# EasyEDA Pro project PCB设计进阶.eprj

# Schematic Schematic1

## Sheets
1 38译码电路: Board Name: Board1; Create Date: 2024-08-05
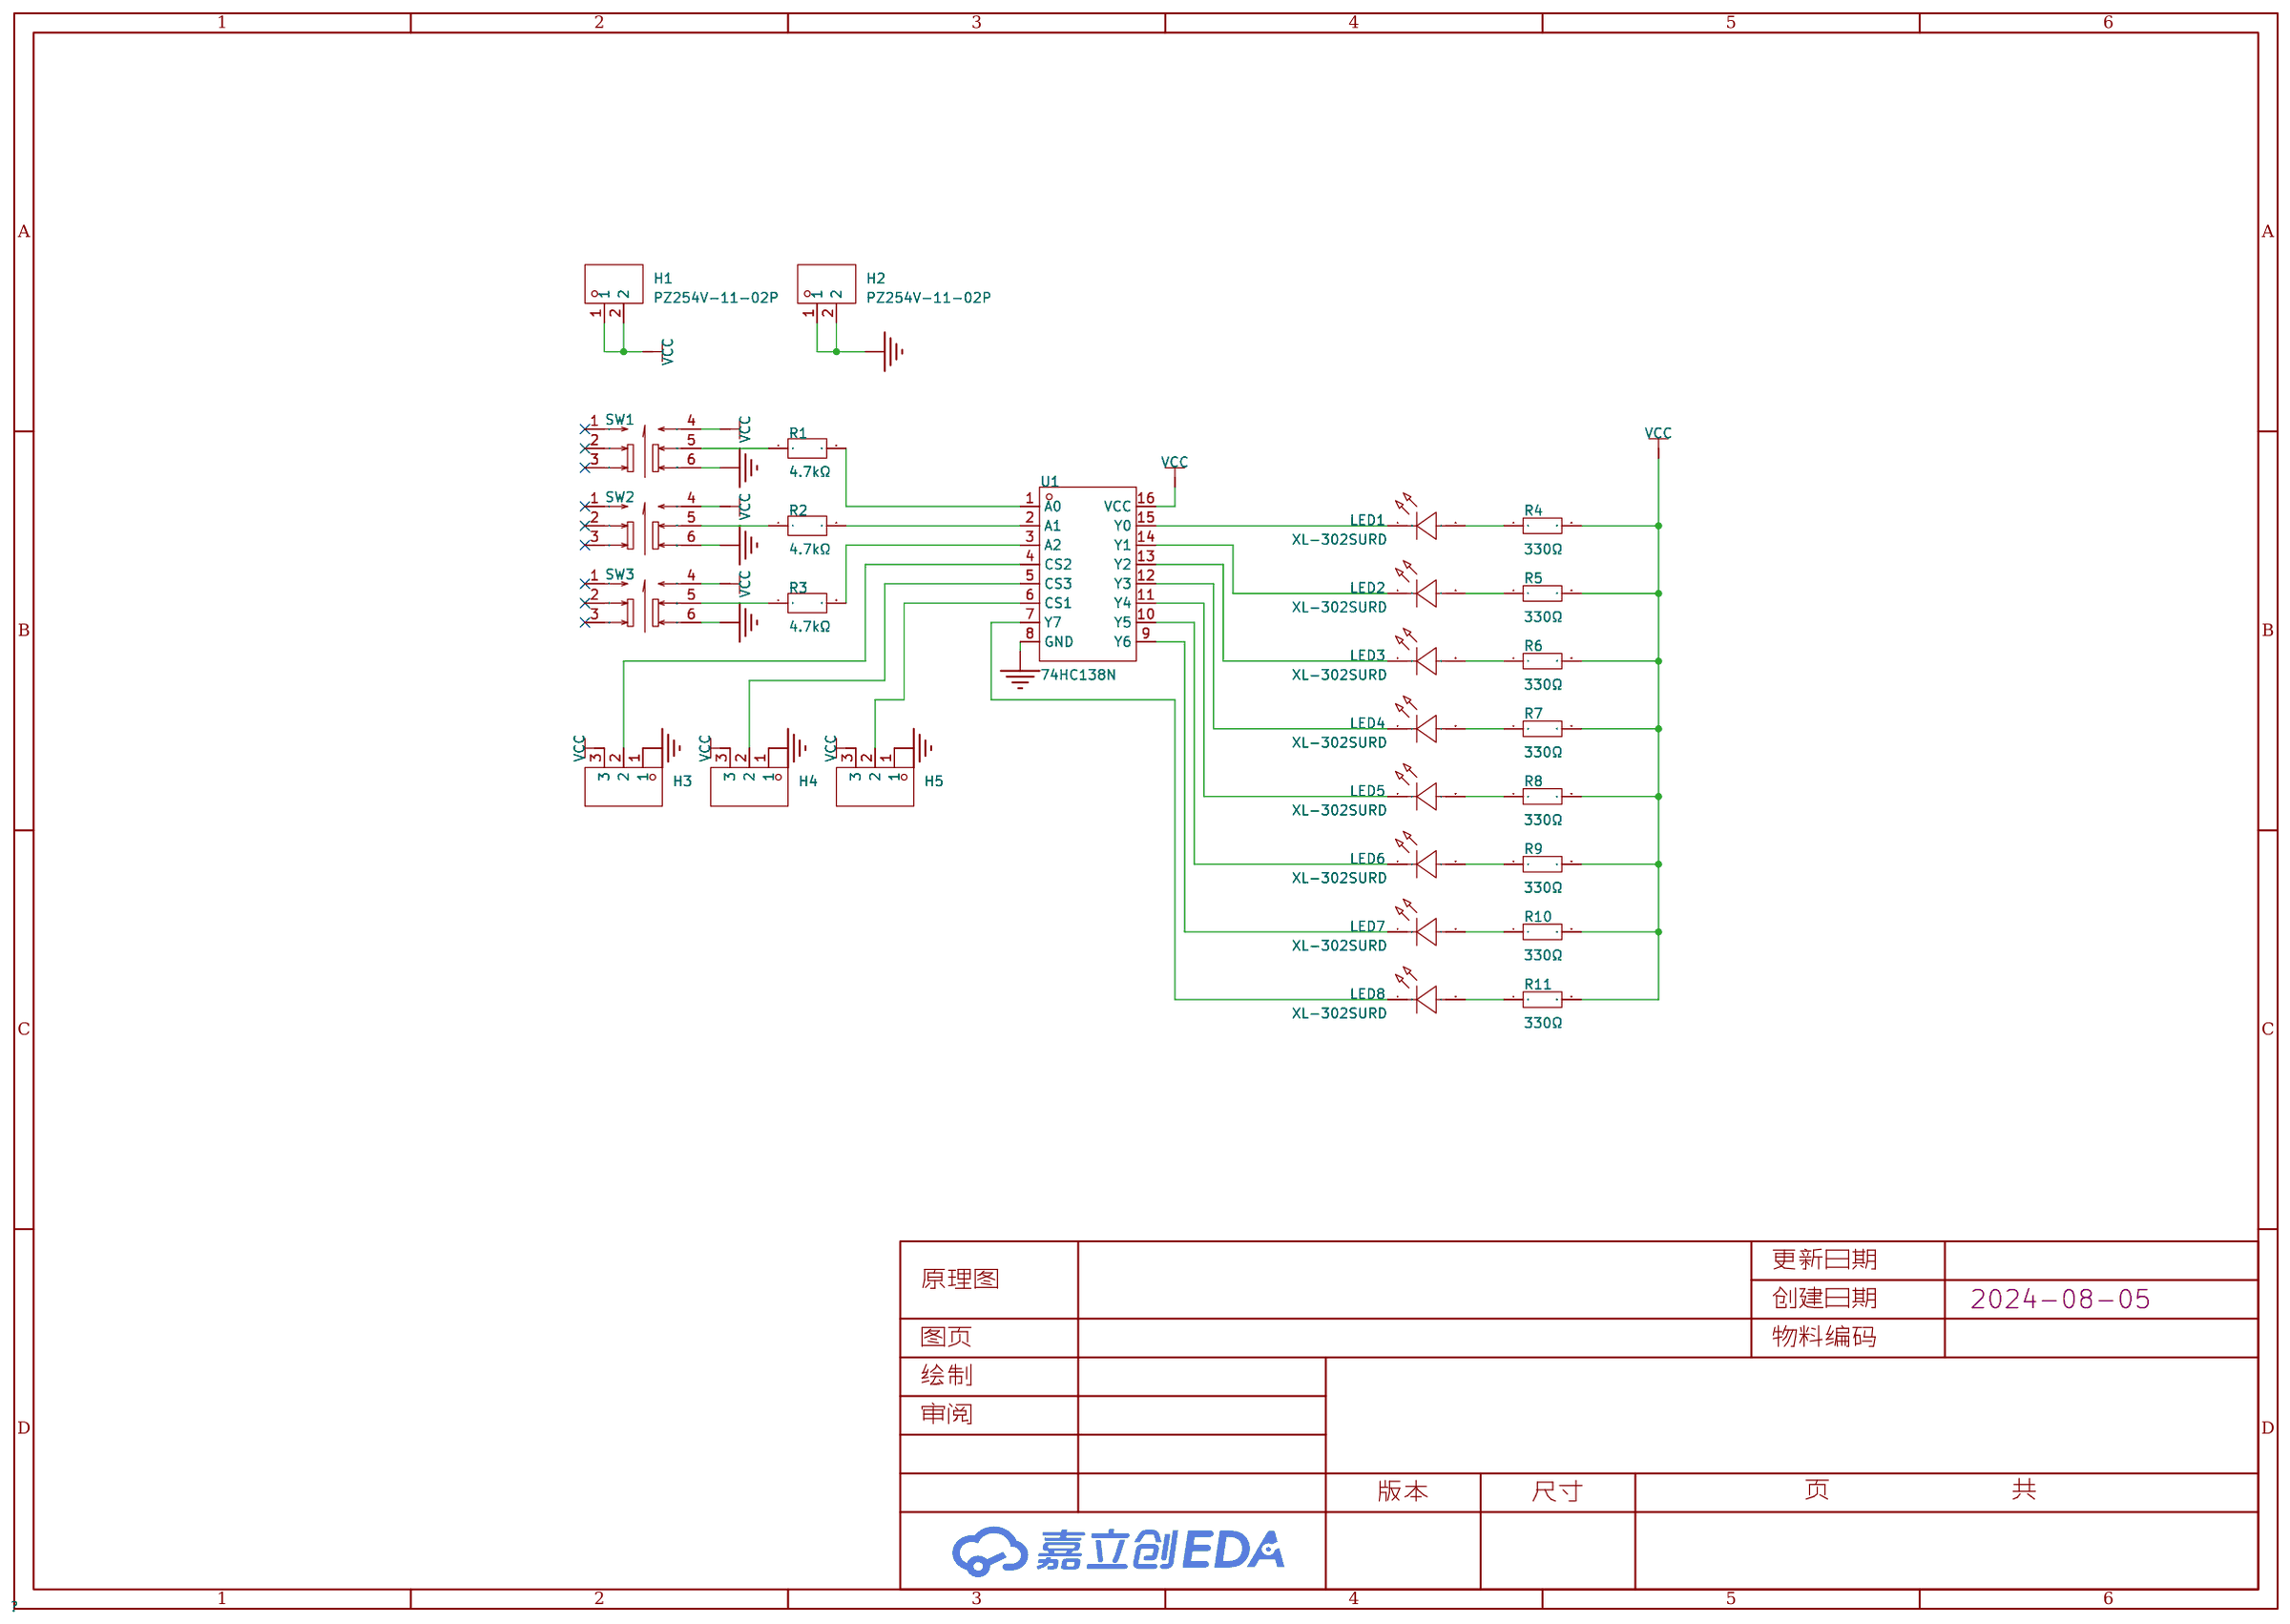
[diagram p0: 38译码电路]
2 245信号放大电路: Create Date: 2024-08-06
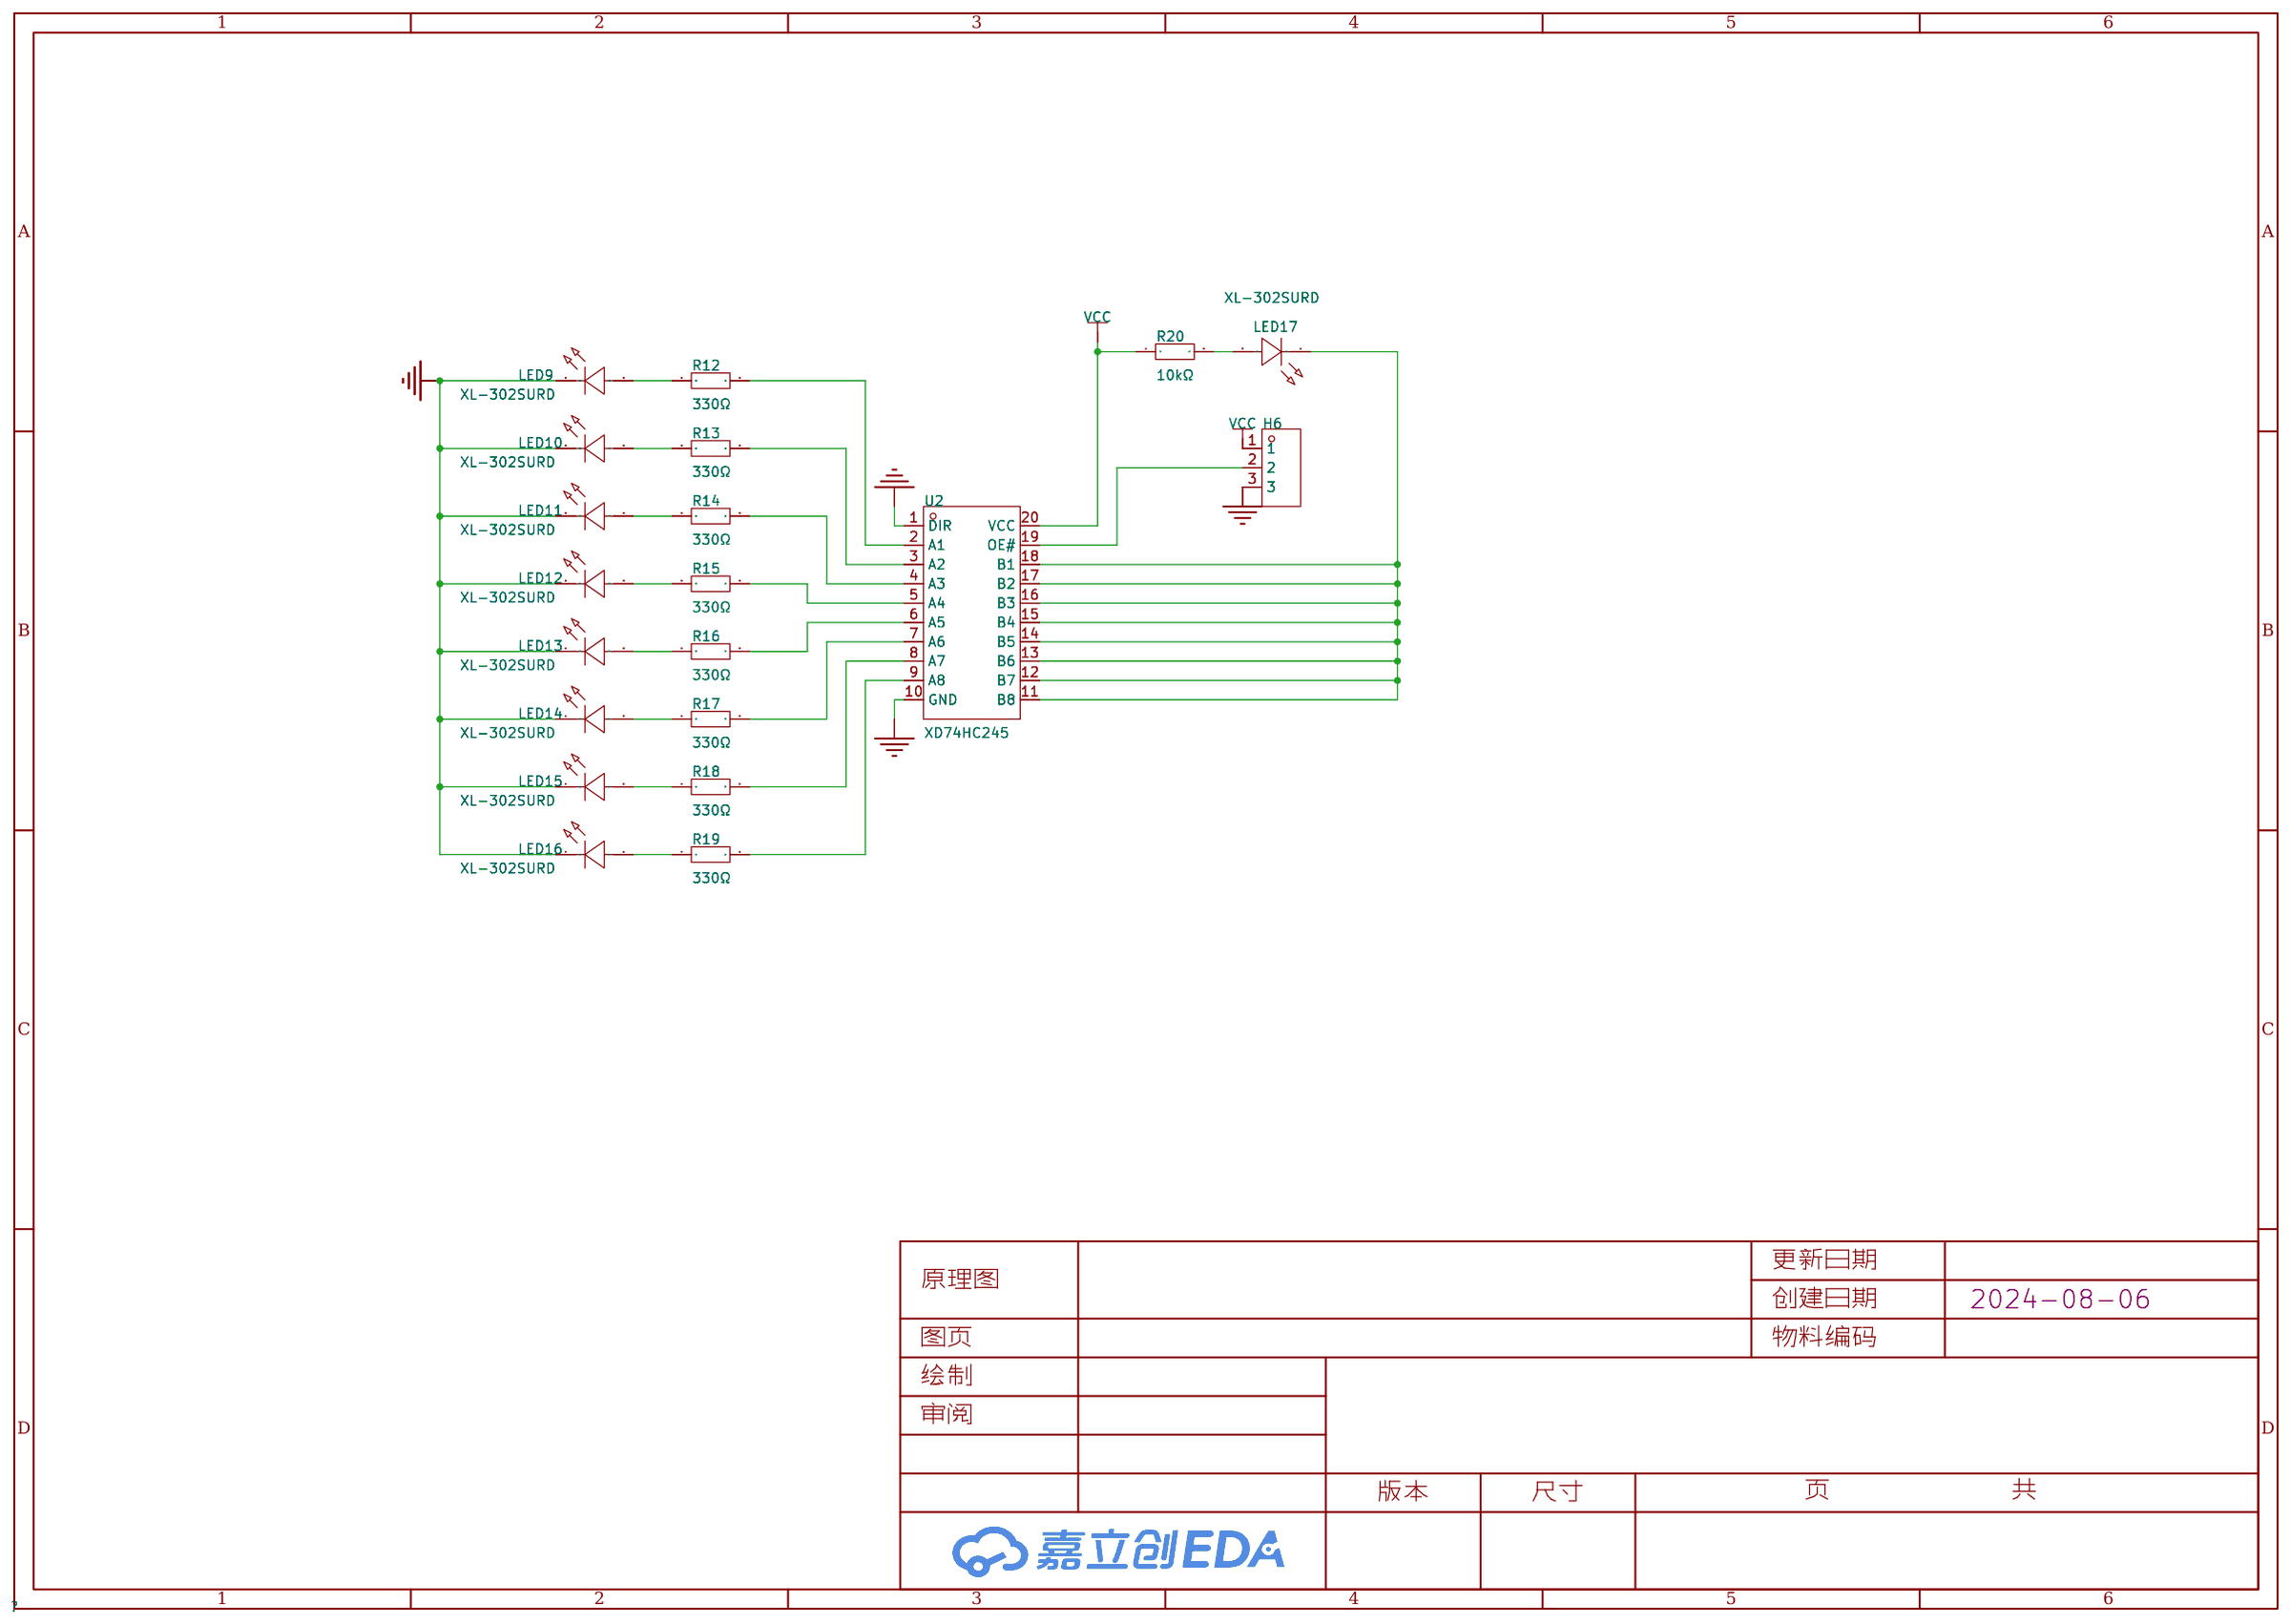
[diagram p1: 245信号放大电路]
3 usb供电: Create Date: 2024-08-06
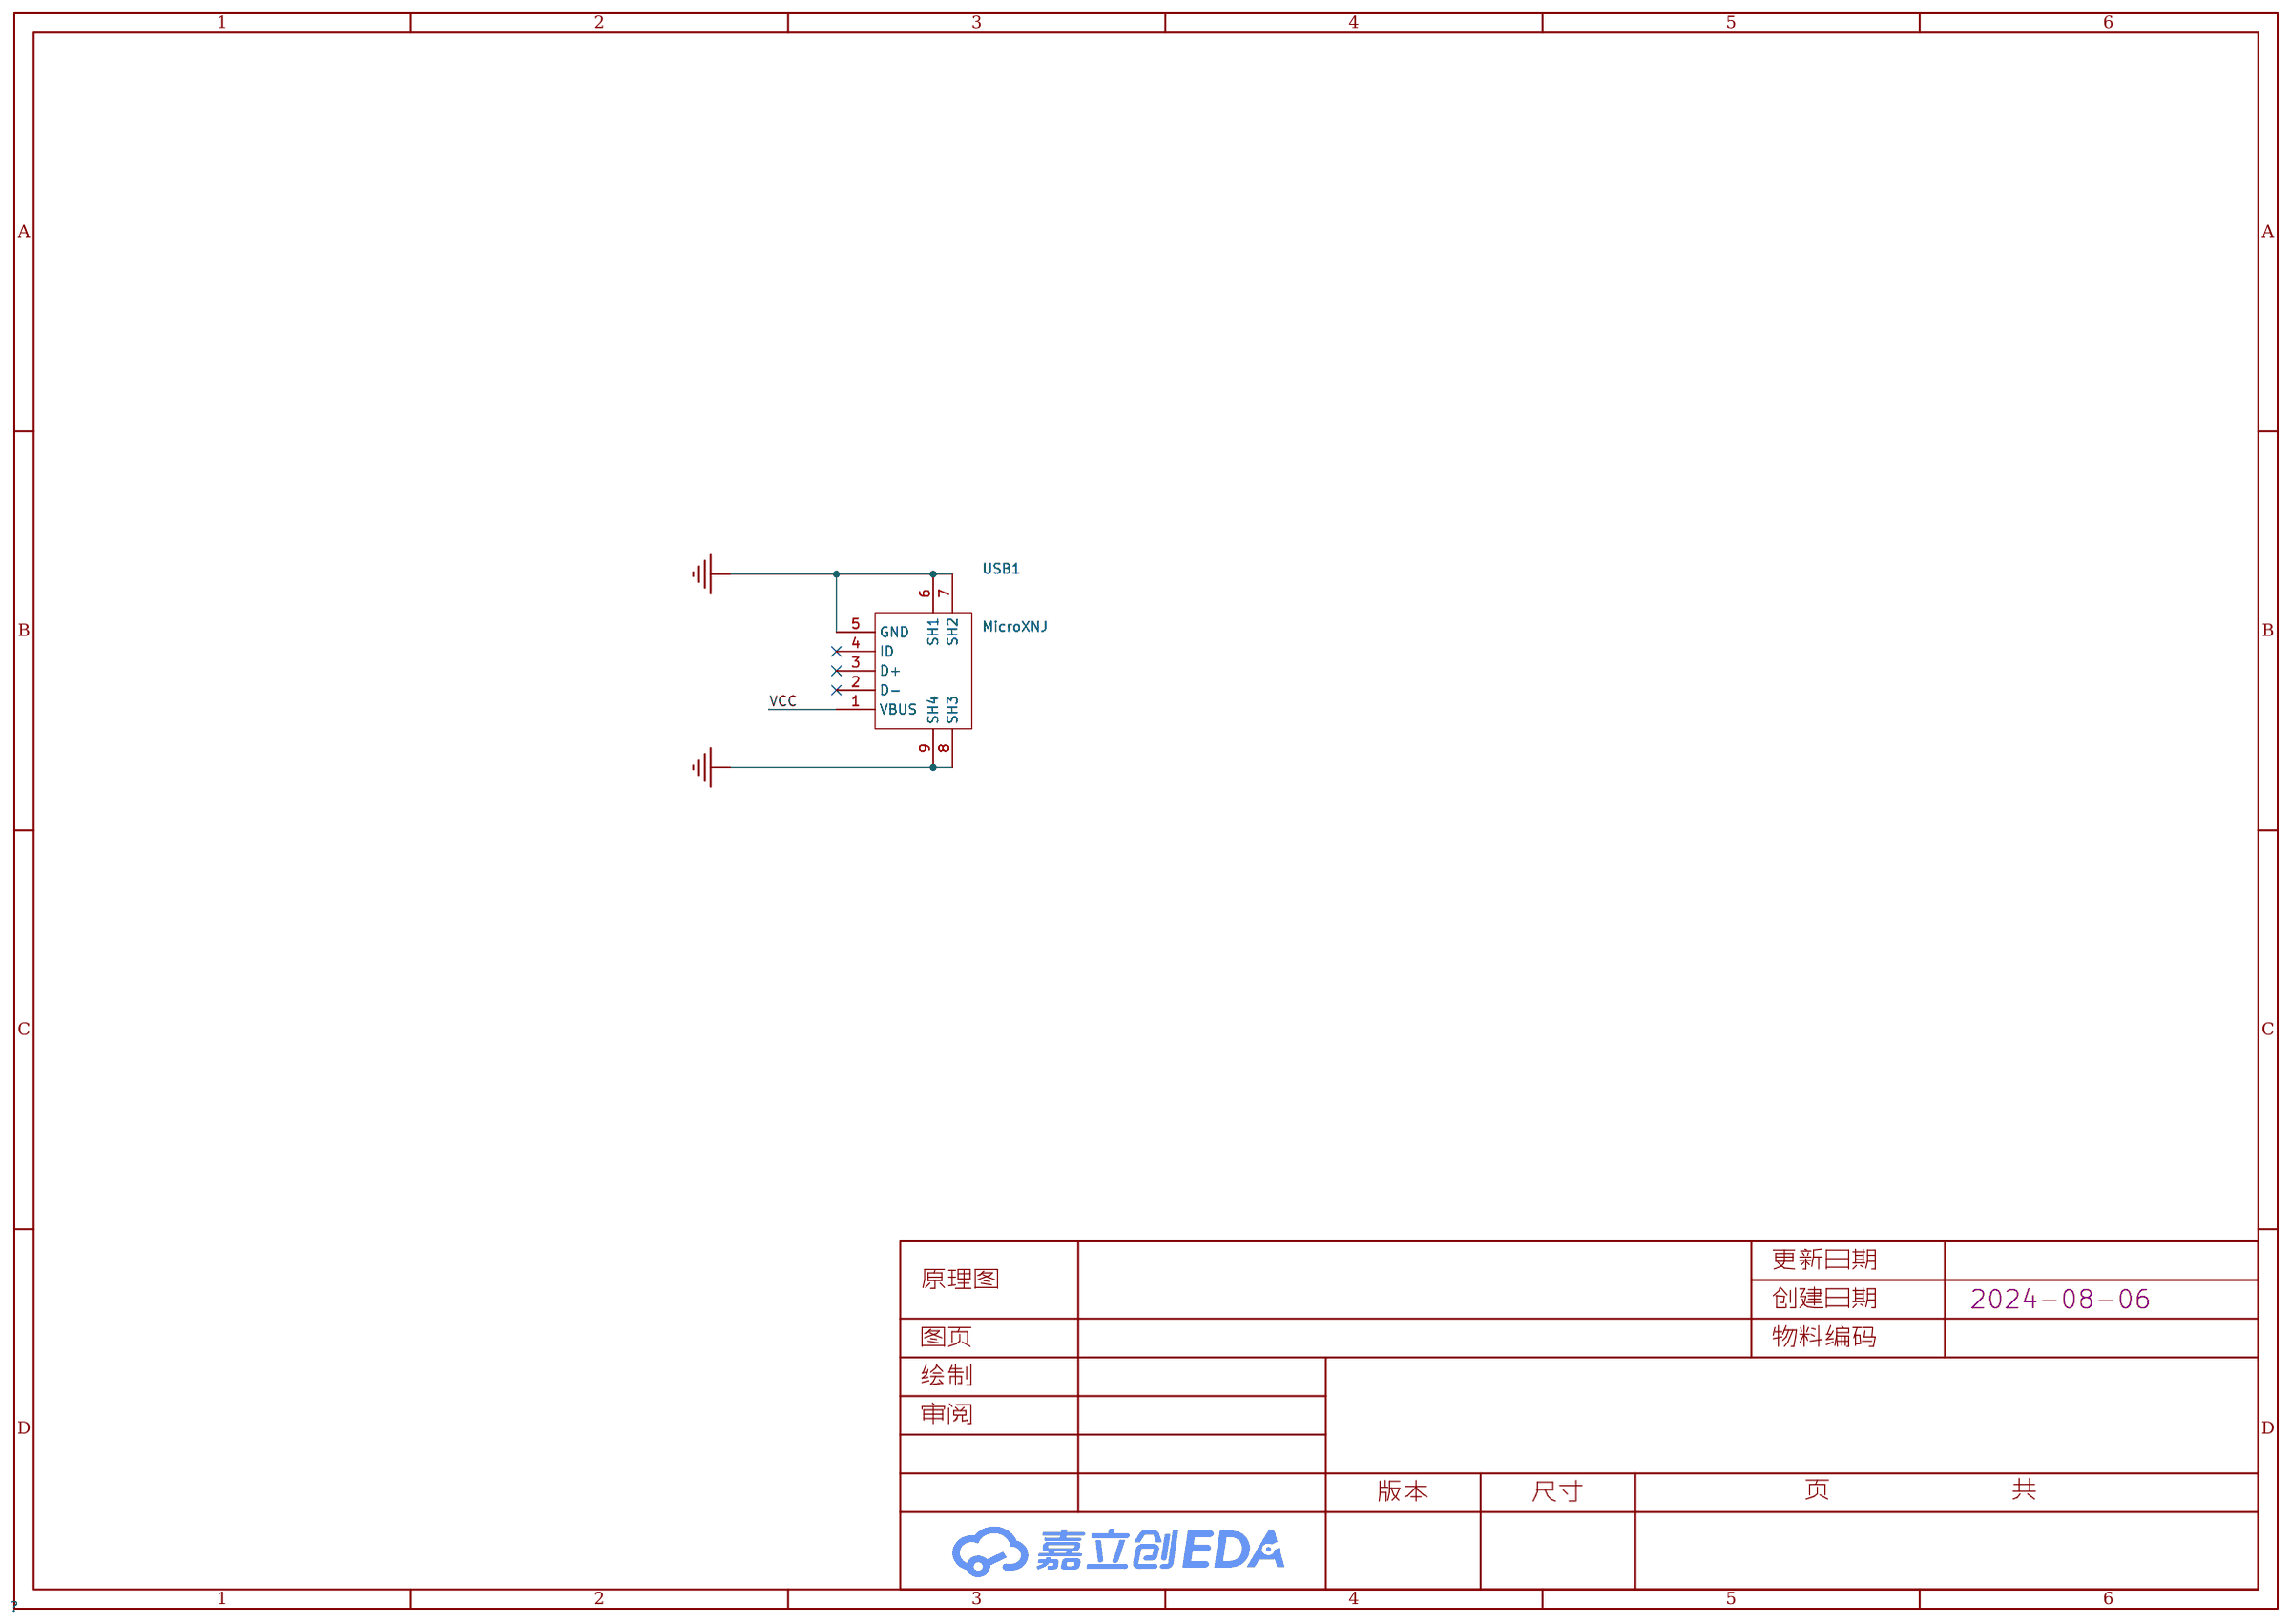
[diagram p2: usb供电]

## Parts
sheet 38译码电路
H1  PZ254V-11-02P  [HDR-TH_2P-P2.54-V-M]
H2  PZ254V-11-02P  [HDR-TH_2P-P2.54-V-M]
H3  PZ254V-11-03P  [HDR-TH_3P-P2.54-V-M]
H4  PZ254V-11-03P  [HDR-TH_3P-P2.54-V-M]
H5  PZ254V-11-03P  [HDR-TH_3P-P2.54-V-M]
LED1  XL-302SURD  [LED-TH_BD3.8-P2.54-RD]
LED2  XL-302SURD  [LED-TH_BD3.8-P2.54-RD]
LED3  XL-302SURD  [LED-TH_BD3.8-P2.54-RD]
LED4  XL-302SURD  [LED-TH_BD3.8-P2.54-RD]
LED5  XL-302SURD  [LED-TH_BD3.8-P2.54-RD]
LED6  XL-302SURD  [LED-TH_BD3.8-P2.54-RD]
LED7  XL-302SURD  [LED-TH_BD3.8-P2.54-RD]
LED8  XL-302SURD  [LED-TH_BD3.8-P2.54-RD]
R1  4.7kΩ  [RES-TH_BD2.4-L6.3-P10.30-D0.6]
R2  4.7kΩ  [RES-TH_BD2.4-L6.3-P10.30-D0.6]
R3  4.7kΩ  [RES-TH_BD2.4-L6.3-P10.30-D0.6]
R4  330Ω  [RES-TH_BD2.3-L3.7-P7.70-D0.9]
R5  330Ω  [RES-TH_BD2.3-L3.7-P7.70-D0.9]
R6  330Ω  [RES-TH_BD2.3-L3.7-P7.70-D0.9]
R7  330Ω  [RES-TH_BD2.3-L3.7-P7.70-D0.9]
R8  330Ω  [RES-TH_BD2.3-L3.7-P7.70-D0.9]
R9  330Ω  [RES-TH_BD2.3-L3.7-P7.70-D0.9]
R10  330Ω  [RES-TH_BD2.3-L3.7-P7.70-D0.9]
R11  330Ω  [RES-TH_BD2.3-L3.7-P7.70-D0.9]
SW1  XKB7070-Z  [SW-TH_6P-L7.0-W7.0-P2.00]
SW2  XKB7070-Z  [SW-TH_6P-L7.0-W7.0-P2.00]
SW3  XKB7070-Z  [SW-TH_6P-L7.0-W7.0-P2.00]
U1  74HC138N  [DIP-16_L19.2-W6.6-P2.54-LS7.6-BL]
sheet 245信号放大电路
H6  PZ254V-11-03P  [HDR-TH_3P-P2.54-V-M]
LED9  XL-302SURD  [LED-TH_BD3.8-P2.54-RD]
LED10  XL-302SURD  [LED-TH_BD3.8-P2.54-RD]
LED11  XL-302SURD  [LED-TH_BD3.8-P2.54-RD]
LED12  XL-302SURD  [LED-TH_BD3.8-P2.54-RD]
LED13  XL-302SURD  [LED-TH_BD3.8-P2.54-RD]
LED14  XL-302SURD  [LED-TH_BD3.8-P2.54-RD]
LED15  XL-302SURD  [LED-TH_BD3.8-P2.54-RD]
LED16  XL-302SURD  [LED-TH_BD3.8-P2.54-RD]
LED17  XL-302SURD  [LED-TH_BD3.8-P2.54-RD]
R12  330Ω  [RES-TH_BD2.3-L3.7-P7.70-D0.9]
R13  330Ω  [RES-TH_BD2.3-L3.7-P7.70-D0.9]
R14  330Ω  [RES-TH_BD2.3-L3.7-P7.70-D0.9]
R15  330Ω  [RES-TH_BD2.3-L3.7-P7.70-D0.9]
R16  330Ω  [RES-TH_BD2.3-L3.7-P7.70-D0.9]
R17  330Ω  [RES-TH_BD2.3-L3.7-P7.70-D0.9]
R18  330Ω  [RES-TH_BD2.3-L3.7-P7.70-D0.9]
R19  330Ω  [RES-TH_BD2.3-L3.7-P7.70-D0.9]
R20  10kΩ  [RES-TH_BD2.3-L6.5-P10.50-D0.5]
U2  XD74HC245  [DIP-20_L26.8-W6.4-P2.54-LS7.6-BL]
sheet usb供电
USB1  MicroXNJ  [MICRO-USB-SMD_MICROXNJ]

## Library data of the parts
H1 H2 = PZ254V-11-02P: LCSC Part Name: 间距:2.54mm 1x2P 直插 方针; Supplier Part: C492401; Manufacturer: XFCN(兴飞); Supplier Footprint: 插件,P=2.54mm; JLCPCB Part Class: 扩展库; Datasheet: https://atta.szlcsc.com/upload/public/pdf/source/20200309/C492401_A812433581A9B211A7FFA413ADDFF0E5.pdf; Supplier: LCSC; Pin Structure: 1x2P; Pitch: 2.54mm; Circluar Pins/Square Pins: 方针; Mounting Type: 直插; Number of Rows: 单排; Number of Pins: 2P; Length of Mating Pin: 6mm; Insulation Height: 2.5mm; Length of End Connection Pin: 3mm; Contact Material: 黄铜; Operating Temperature Range: -40℃~+105℃; Color: 黑色
H3-H6 = PZ254V-11-03P: LCSC Part Name: 间距:2.54mm 1x3P 直插 方针; Supplier Part: C2937625; Manufacturer: XFCN(兴飞); Supplier Footprint: 插件,P=2.54mm; JLCPCB Part Class: 扩展库; Datasheet: https://atta.szlcsc.com/upload/public/pdf/source/20200309/C492402_8335C3D49C4E4C618838D59BB1D024C1.pdf; Supplier: LCSC; Pin Structure: 1x3P; Pitch: 2.54mm; Circluar Pins/Square Pins: 方针; Mounting Type: 直插; Number of Rows: 单排; Number of Pins: 3P; Current Rating (Max): 3A; Voltage Rating (Max): 250V; Length of Mating Pin: 6mm; Insulation Height: 2.5mm; Length of End Connection Pin: 3mm; Operating Temperature Range: -40℃~+105℃; Color: 黑色
LED1-LED17 = XL-302SURD: Supplier Part: C2895470; Manufacturer: XINGLIGHT(成兴光); Supplier Footprint: 插件,D=3mm; JLCPCB Part Class: 扩展库; Datasheet: https://atta.szlcsc.com/upload/public/pdf/source/20240112/E1E2B82945FD635E4907401DDE6D4922.pdf; Supplier: LCSC; Lamp Holder Type: 3mm圆形灯头; Emitted Color: 红色; Power Dissipation: 80mW; Forward Current: 30mA; Dominant Wavelength: 615nm~620nm; Peak Wavelength: 625nm; Lens Color: 红色透镜; Viewing Angle: 50°; Operating Temperature: -25℃~+85℃
R1-R3 = RN1/4W4K7FT/BA1: LCSC Part Name: 4.7kΩ ±1% 250mW 金属膜电阻; Supplier Part: C410614; Manufacturer: Tyohm(幸亚电阻); Supplier Footprint: 插件,D2.4xL6.5mm; JLCPCB Part Class: 扩展库; Datasheet: https://atta.szlcsc.com/upload/public/pdf/source/20190808/C410699_D126E64D28B638F1D73B58E9F61DFD9B.pdf; Supplier: LCSC; Type: 金属膜电阻; Tolerance: ±1%; Overload Voltage (Max): 250V; Power(Watts): 250mW; Temperature Coefficient: ±50ppm/℃; Operating Temperature Range: -55℃~+125℃
R4-R19 = MF1/8W-330Ω±1%-OT52: LCSC Part Name: 金属膜电阻 330Ω ±1% 125mW; Supplier Part: C2848567; Manufacturer: VO(翔胜); Supplier Footprint: 插件,D2.3xL3.7mm; JLCPCB Part Class: 扩展库; Supplier: LCSC; Type: 金属膜电阻; Tolerance: ±1%; Overload Voltage (Max): 200V; Power(Watts): 125mW; Temperature Coefficient: ±350ppm/℃; Operating Temperature Range: -55℃~+155℃
SW1-SW3 = XKB7070-Z: LCSC Part Name: 按键开关   7*7插件自锁 蓝白黑; Supplier Part: C318863; Manufacturer: XKB Connectivity(中国星坤); Supplier Footprint: 插件; JLCPCB Part Class: 扩展库; Datasheet: https://atta.szlcsc.com/upload/public/pdf/source/20211015/75A682A27A424BDE8D93C2CFA14C38FE.pdf; Supplier: LCSC; Self Lock / No Lock: 自锁; Actuator Style: 矩形按钮; Mounting Style: 直插; Contact Current: 100mA; Voltage Rating (AC): 250V; Voltage Rating (DC): 30V; Insulation Resistance: 100MΩ; Actuator/Cap Color: 蓝色; With Lamp: 不带; Pin Style: PC引脚; Operating Force: 160gf; Operating Temperature: -15℃~+55℃; Mechanical Life: 10万次
U1 = 74HC138N: LCSC Part Name: 3 线路至 8 线路解码器/多路解复用器; Supplier Part: C507188; Manufacturer: HGSEMI(华冠); Supplier Footprint: DIP-16; JLCPCB Part Class: 扩展库; Datasheet: https://atta.szlcsc.com/upload/public/pdf/source/20200402/C507188_F3819AAFA86CA4EC01049E7C3DE0780C.pdf; Supplier: LCSC
R20 = RI40-1/4W-10KΩ±5%T: LCSC Part Name: 玻璃釉电阻 10kΩ ±5% 250mW 粉色漆; Supplier Part: C714634; Manufacturer: 华星机电; Supplier Footprint: 插件; JLCPCB Part Class: 扩展库; Datasheet: https://atta.szlcsc.com/upload/public/pdf/source/20200731/C714531_AD63ADE1939354DF9C89AA88364E3DE5.pdf; Supplier: LCSC; Type: 玻璃釉电阻; Tolerance: ±5%; Power(Watts): 250mW; Temperature Coefficient: ±200ppm/℃; Operating Temperature Range: -55℃~+125℃
U2 = XD74HC245: LCSC Part Name: 总线收发器; Supplier Part: C561305; Manufacturer: XINLUDA(信路达); Supplier Footprint: DIP-20; JLCPCB Part Class: 扩展库; Datasheet: https://atta.szlcsc.com/upload/public/pdf/source/20240111/A572988226579F08DBAC30D4B3CE857F.pdf; Supplier: LCSC
USB1 = MicroXNJ: LCSC Part Name: Micro-B 母 卧贴; Supplier Part: C404969; Manufacturer: SHOU HAN(首韩); Supplier Footprint: SMD; JLCPCB Part Class: 扩展库; Datasheet: https://atta.szlcsc.com/upload/public/pdf/source/20220415/2494EDFF499AF6F852F7C820374B6AF3.pdf; Supplier: LCSC; Connector Type: Micro-B; Standard: USB 2.0; Gender: 母; Mounting Style: 卧贴; Number of Contacts: 5P; Number of Ports: 1; Current Rating - Power (Max): 1A; Operating Temperature Range: -20℃~+85℃

## Nets
GND: H2.1 H2.2 H3.1 H4.1 H5.1 H6.3 LED9.1(K) LED10.1(K) LED11.1(K) LED12.1(K) LED13.1(K) LED14.1(K) LED15.1(K) LED16.1(K) SW1.6 SW2.6 SW3.6 U1.8(GND) U2.1(DIR) U2.10(GND) USB1.5(GND) USB1.6(SH1) USB1.7(SH2) USB1.8(SH3) USB1.9(SH4)
VCC: H1.1 H1.2 H3.3 H4.3 H5.3 H6.1 R4.2 R5.2 R6.2 R7.2 R8.2 R9.2 R10.2 R11.2 R20.1 SW1.4 SW2.4 SW3.4 U1.16(VCC) U2.20(VCC) USB1.1(VBUS)
$1N957: R1.2 U1.1(A0)
$1N969: R3.2 U1.3(A2)
$1N1133: R2.1 SW2.5
$1N1140: R1.1 SW1.5
$1N1148: R3.1 SW3.5
$1N1162: R2.2 U1.2(A1)
$1N1502: H3.2 U1.4(CS2)
$1N1509: H4.2 U1.5(CS3)
$1N1517: H5.2 U1.6(CS1)
$1N1681: LED1.2(A) R4.1
$1N1764: LED2.2(A) R5.1
$1N2002: LED3.2(A) R6.1
$1N2004: LED4.2(A) R7.1
$1N2318: LED5.2(A) R8.1
$1N2320: LED6.2(A) R9.1
$1N2322: LED7.2(A) R10.1
$1N2324: LED8.2(A) R11.1
$1N2481: LED1.1(K) U1.15(Y0)
$1N2515: LED4.1(K) U1.12(Y3)
$1N2530: LED5.1(K) U1.11(Y4)
$1N2537: LED6.1(K) U1.10(Y5)
$1N2544: LED7.1(K) U1.9(Y6)
$1N2551: LED8.1(K) U1.7(Y7)
$1N2573: LED2.1(K) U1.14(Y1)
$1N2577: LED3.1(K) U1.13(Y2)
$2N664: LED9.2(A) R12.1
$2N666: LED10.2(A) R13.1
$2N668: LED11.2(A) R14.1
$2N670: LED12.2(A) R15.1
$2N672: LED13.2(A) R16.1
$2N674: LED14.2(A) R17.1
$2N676: LED15.2(A) R18.1
$2N678: LED16.2(A) R19.1
$2N1075: R15.2 U2.5(A4)
$2N1092: R16.2 U2.6(A5)
$2N1099: R14.2 U2.4(A3)
$2N1109: R13.2 U2.3(A2)
$2N1119: R12.2 U2.2(A1)
$2N1129: R17.2 U2.7(A6)
$2N1136: R18.2 U2.8(A7)
$2N1143: R19.2 U2.9(A8)
$2N1301: LED17.2(A) R20.2
$2N1318: LED17.1(K) U2.11(B8) U2.12(B7) U2.13(B6) U2.14(B5) U2.15(B4) U2.16(B3) U2.17(B2) U2.18(B1)
$2N1542: H6.2 U2.19(OE#)

Not connected (* = marked no-connect by the designer): SW1 1* 2* 3*; SW2 1* 2* 3*; SW3 1* 2* 3*; USB1 2(D-)* 3(D+)* 4(ID)*

# Board PCB1
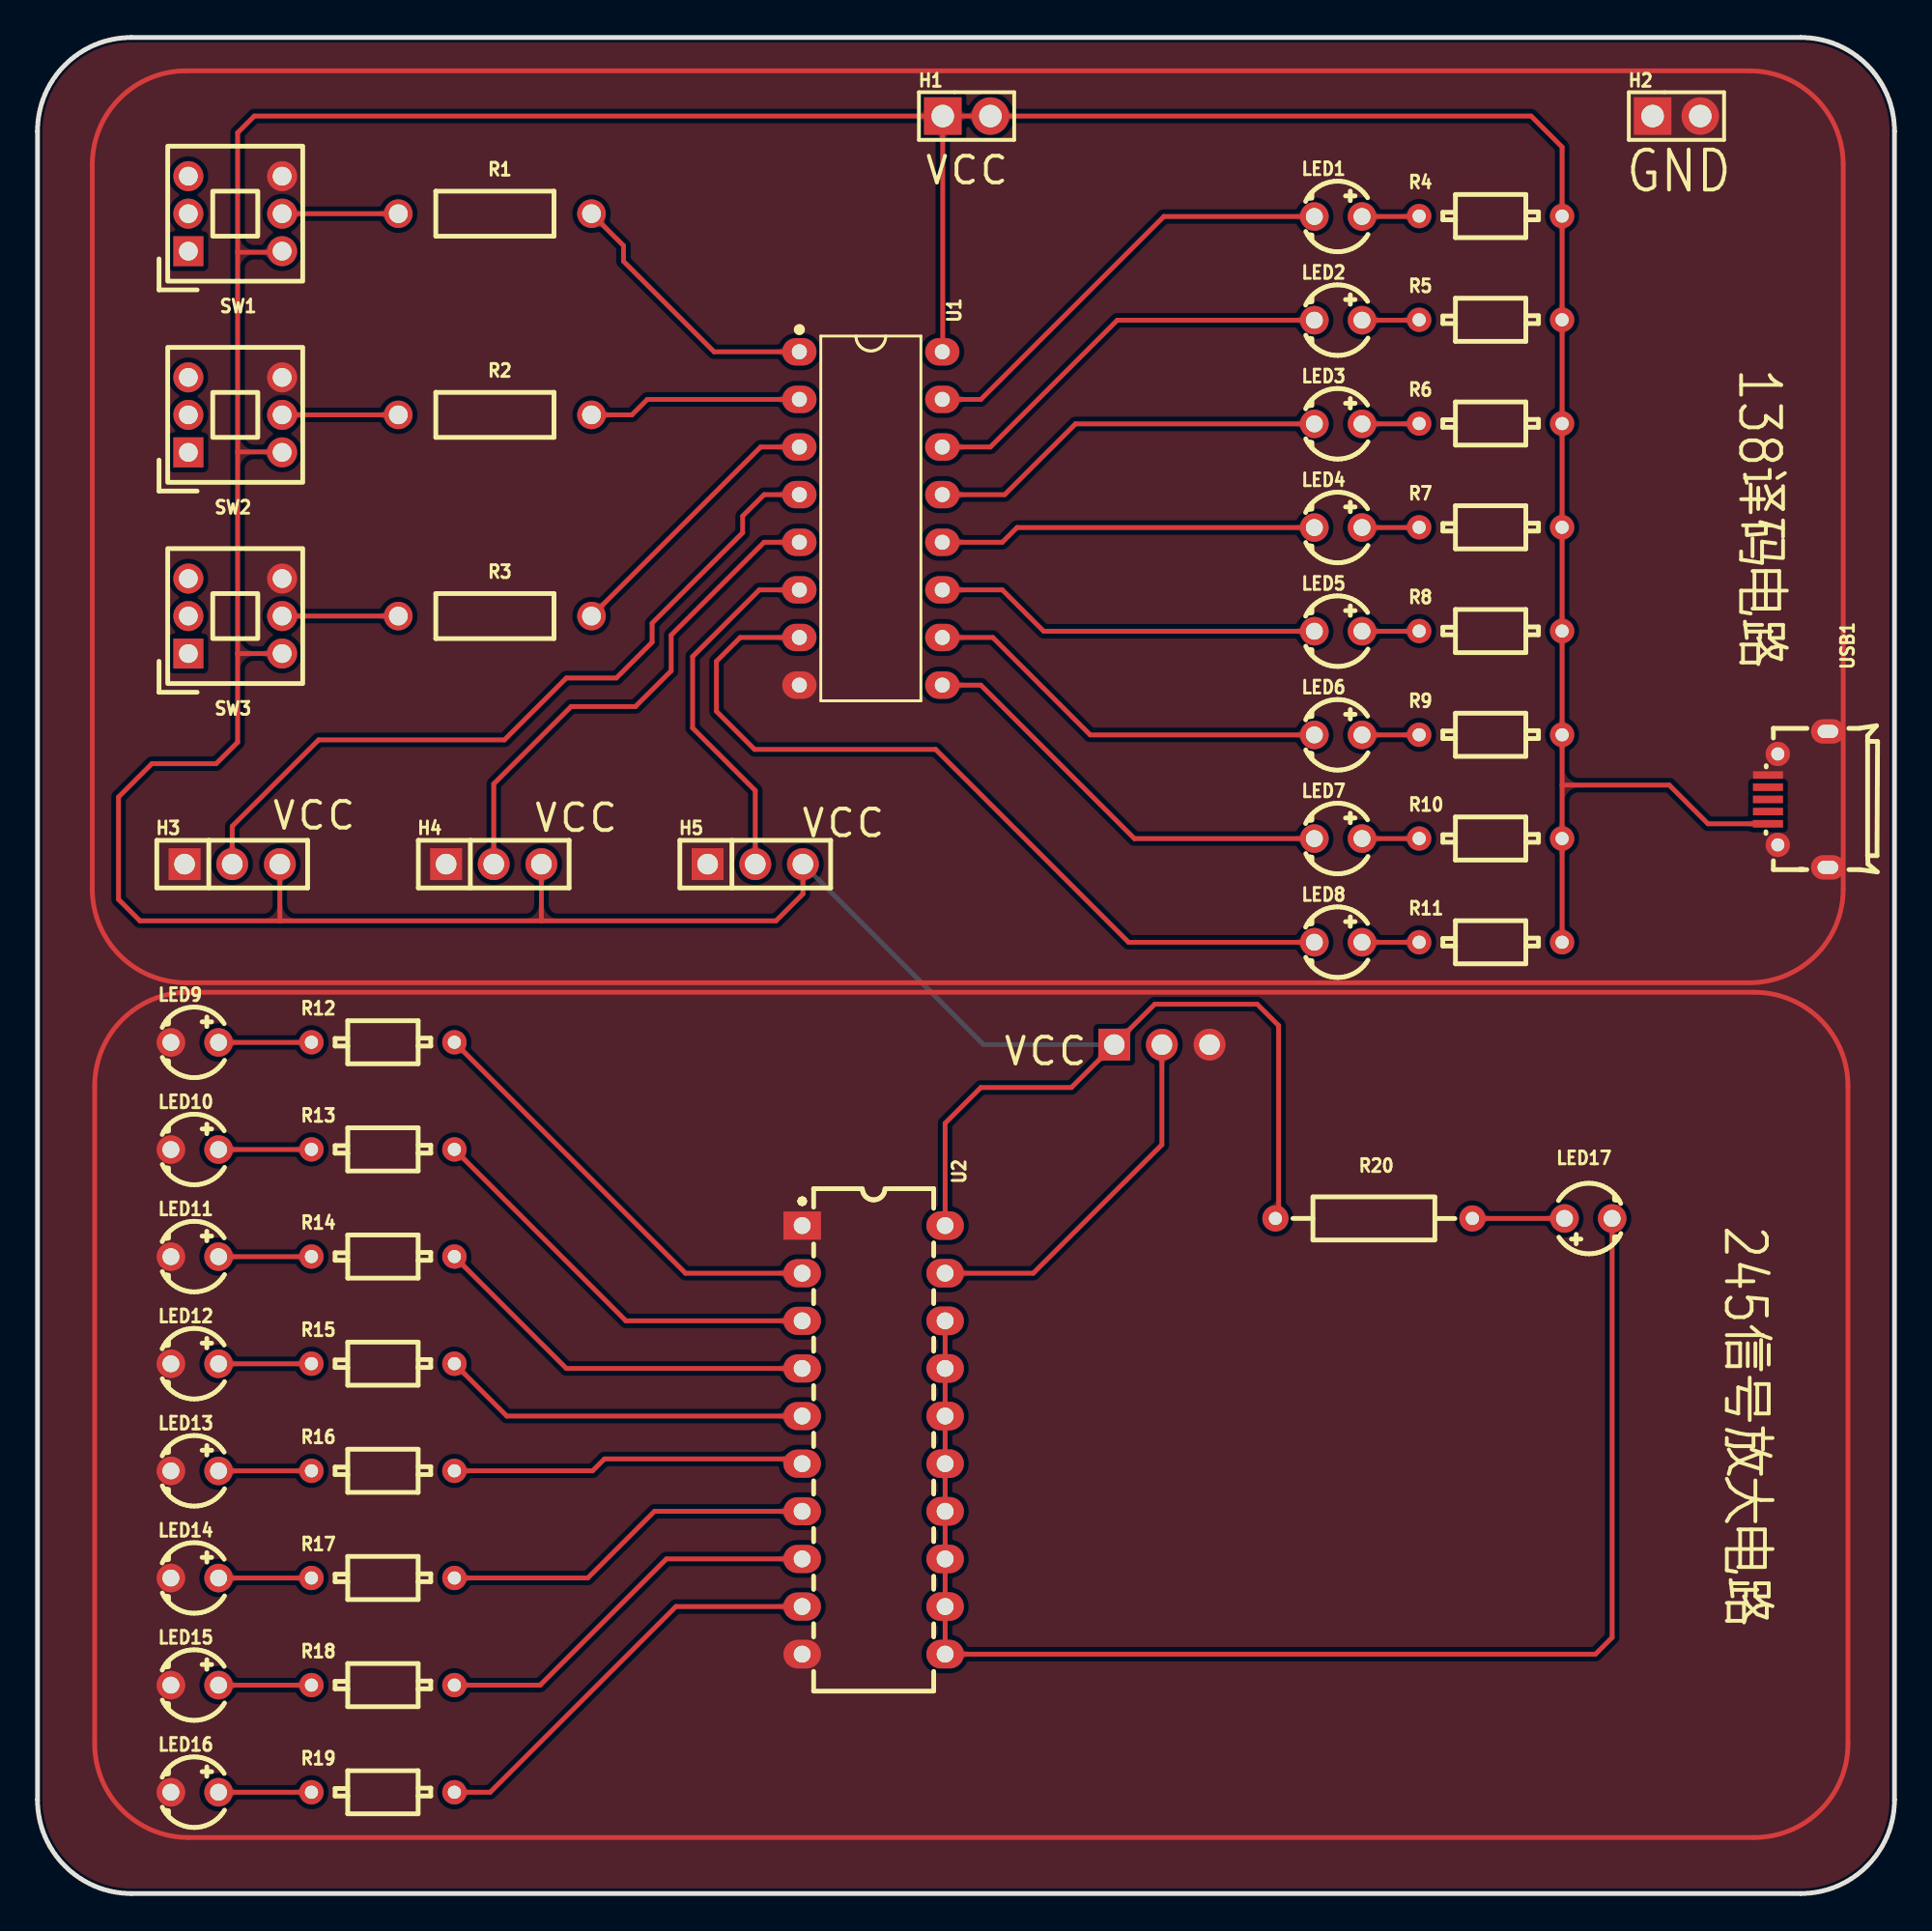
[diagram p3: board, top side]
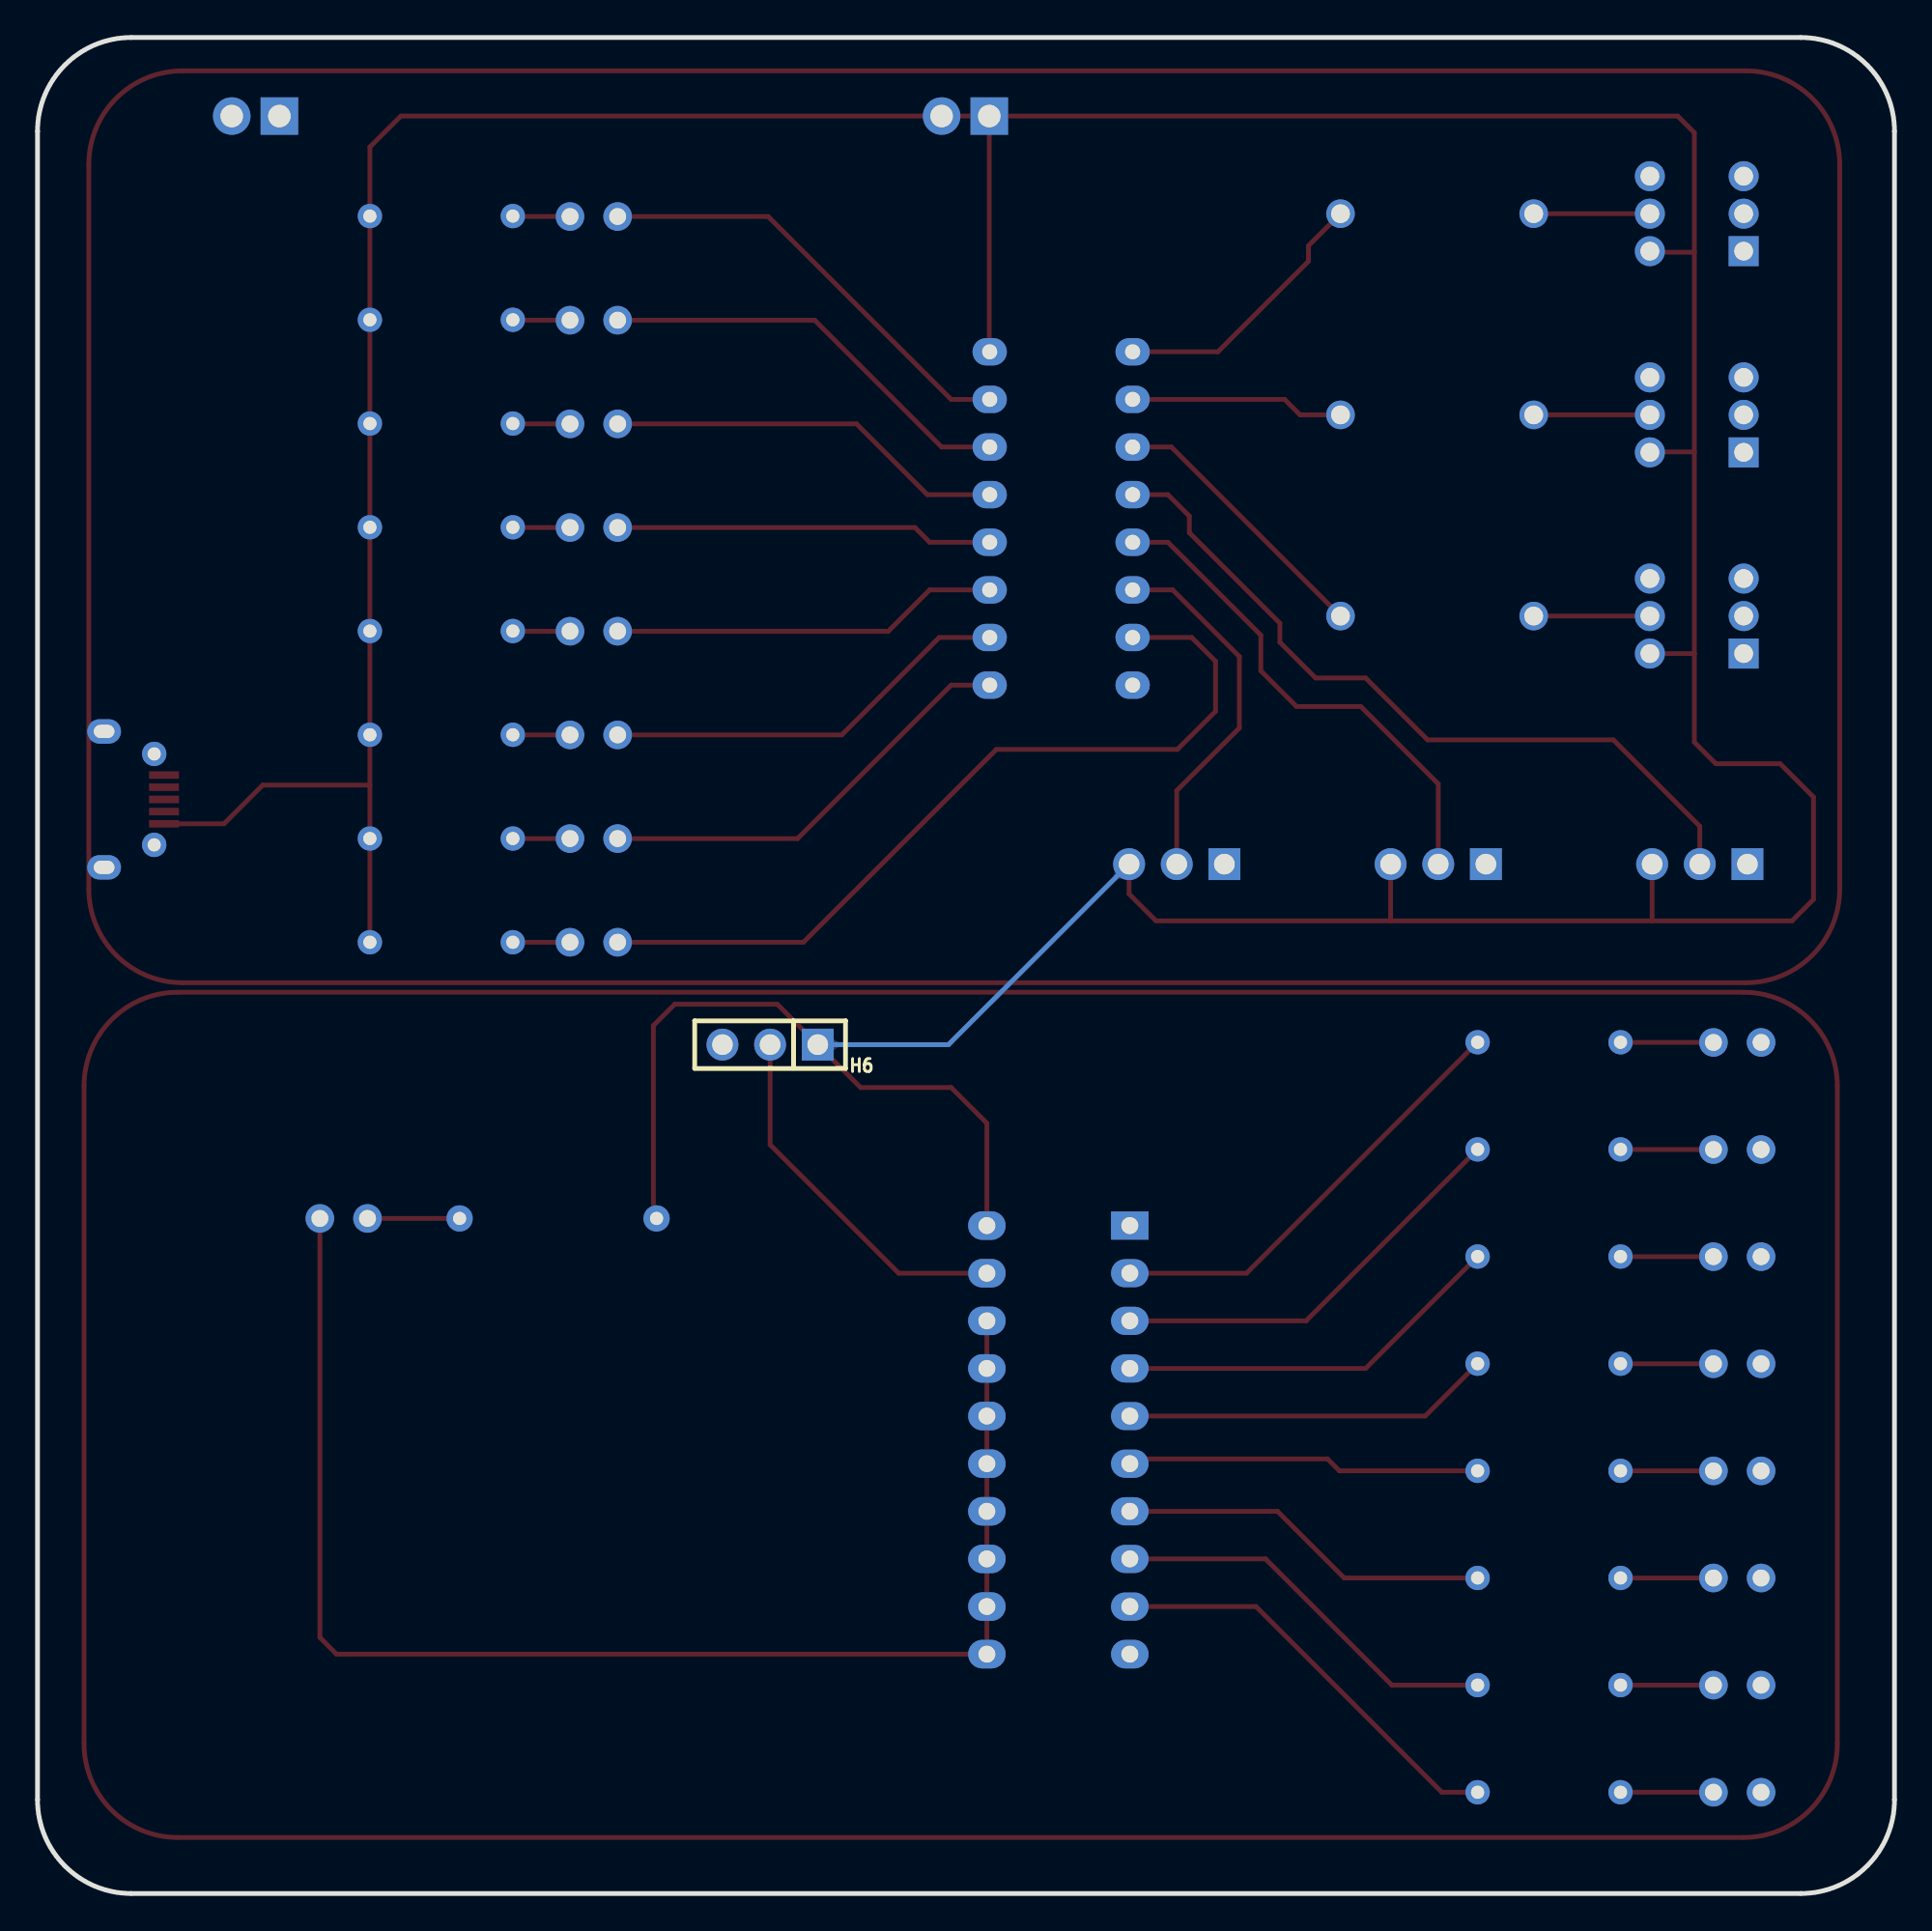
[diagram p4: board, bottom side, seen from below]

Outline 99 x 99 mm; copper layers: Top Layer, Bottom Layer. Coordinates in mm from the lower left corner of the outline.
Outline path: 0,94 0,5 arc(1.46,1.46) 5,0 94,0 arc(97.54,1.46) 99,5 99,94 arc(97.54,97.54) 94,99 5,99 arc(1.46,97.54) 0,94
Stack: Top Layer 0.035mm / Dielectric1 1.51mm FR4 er 4.5 / Bottom Layer 0.035mm

## Design rules (mm)
template: 自定义配置
spacing copperThickness1oz (default): track to track 0.102, other pairs 0.152 to 0.3
spacing copperThickness2oz: track to track 0.203, other pairs 0.152 to 0.3
track width copperThickness1oz (default): min 0.127, default 0.254, max 2.54
track width copperThickness2oz: min 0.203, default 0.254, max 2.54
differential pair differentialPair (default): width min 0.127, default 0.254, max 2.54; gap min 0.152, default 0.152
via viaSize (default): diameter min 0.5, default 0.61, max 10; hole min 0.3, default 0.305, max 6.3

## Placement (name value [footprint] x y rotation side)
H1  PZ254V-11-02P  [HDR-TH_2P-P2.54-V-M]  49.53 94.81 0 top
H2  PZ254V-11-02P  [HDR-TH_2P-P2.54-V-M]  87.38 94.81 0 top
H3  PZ254V-11-03P  [HDR-TH_3P-P2.54-V-M]  10.38 54.91 0 top
H4  PZ254V-11-03P  [HDR-TH_3P-P2.54-V-M]  24.32 54.91 0 top
H5  PZ254V-11-03P  [HDR-TH_3P-P2.54-V-M]  38.27 54.91 0 top
H6  PZ254V-11-03P  [HDR-TH_3P-P2.54-V-M]  59.94 45.28 0 bottom
LED1  XL-302SURD  [LED-TH_BD3.8-P2.54-RD]  69.34 89.45 0 top
LED2  XL-302SURD  [LED-TH_BD3.8-P2.54-RD]  69.34 83.92 0 top
LED3  XL-302SURD  [LED-TH_BD3.8-P2.54-RD]  69.34 78.39 0 top
LED4  XL-302SURD  [LED-TH_BD3.8-P2.54-RD]  69.34 72.86 0 top
LED5  XL-302SURD  [LED-TH_BD3.8-P2.54-RD]  69.34 67.33 0 top
LED6  XL-302SURD  [LED-TH_BD3.8-P2.54-RD]  69.34 61.8 0 top
LED7  XL-302SURD  [LED-TH_BD3.8-P2.54-RD]  69.34 56.27 0 top
LED8  XL-302SURD  [LED-TH_BD3.8-P2.54-RD]  69.34 50.74 0 top
LED9  XL-302SURD  [LED-TH_BD3.8-P2.54-RD]  8.38 45.4 0 top
LED10  XL-302SURD  [LED-TH_BD3.8-P2.54-RD]  8.38 39.68 0 top
LED11  XL-302SURD  [LED-TH_BD3.8-P2.54-RD]  8.38 33.97 0 top
LED12  XL-302SURD  [LED-TH_BD3.8-P2.54-RD]  8.38 28.26 0 top
LED13  XL-302SURD  [LED-TH_BD3.8-P2.54-RD]  8.38 22.54 0 top
LED14  XL-302SURD  [LED-TH_BD3.8-P2.54-RD]  8.38 16.83 0 top
LED15  XL-302SURD  [LED-TH_BD3.8-P2.54-RD]  8.38 11.11 0 top
LED16  XL-302SURD  [LED-TH_BD3.8-P2.54-RD]  8.38 5.4 0 top
LED17  XL-302SURD  [LED-TH_BD3.8-P2.54-RD]  82.68 36.01 180 top
R1  4.7kΩ  [RES-TH_BD2.4-L6.3-P10.30-D0.6]  24.38 89.6 0 top
R2  4.7kΩ  [RES-TH_BD2.4-L6.3-P10.30-D0.6]  24.38 78.87 0 top
R3  4.7kΩ  [RES-TH_BD2.4-L6.3-P10.30-D0.6]  24.38 68.14 0 top
R4  330Ω  [RES-TH_BD2.3-L3.7-P7.70-D0.9]  77.47 89.47 0 top
R5  330Ω  [RES-TH_BD2.3-L3.7-P7.70-D0.9]  77.47 83.94 0 top
R6  330Ω  [RES-TH_BD2.3-L3.7-P7.70-D0.9]  77.47 78.41 0 top
R7  330Ω  [RES-TH_BD2.3-L3.7-P7.70-D0.9]  77.47 72.87 0 top
R8  330Ω  [RES-TH_BD2.3-L3.7-P7.70-D0.9]  77.47 67.34 0 top
R9  330Ω  [RES-TH_BD2.3-L3.7-P7.70-D0.9]  77.47 61.81 0 top
R10  330Ω  [RES-TH_BD2.3-L3.7-P7.70-D0.9]  77.47 56.27 0 top
R11  330Ω  [RES-TH_BD2.3-L3.7-P7.70-D0.9]  77.47 50.74 0 top
R12  330Ω  [RES-TH_BD2.3-L3.7-P7.70-D0.9]  18.42 45.41 0 top
R13  330Ω  [RES-TH_BD2.3-L3.7-P7.70-D0.9]  18.42 39.69 0 top
R14  330Ω  [RES-TH_BD2.3-L3.7-P7.70-D0.9]  18.42 33.98 0 top
R15  330Ω  [RES-TH_BD2.3-L3.7-P7.70-D0.9]  18.42 28.26 0 top
R16  330Ω  [RES-TH_BD2.3-L3.7-P7.70-D0.9]  18.42 22.55 0 top
R17  330Ω  [RES-TH_BD2.3-L3.7-P7.70-D0.9]  18.42 16.83 0 top
R18  330Ω  [RES-TH_BD2.3-L3.7-P7.70-D0.9]  18.42 11.12 0 top
R19  330Ω  [RES-TH_BD2.3-L3.7-P7.70-D0.9]  18.42 5.4 0 top
R20  10kΩ  [RES-TH_BD2.3-L6.5-P10.50-D0.5]  71.25 36.01 0 top
SW1  XKB7070-Z  [SW-TH_6P-L7.0-W7.0-P2.00]  10.54 89.6 180 top
SW2  XKB7070-Z  [SW-TH_6P-L7.0-W7.0-P2.00]  10.54 78.87 180 top
SW3  XKB7070-Z  [SW-TH_6P-L7.0-W7.0-P2.00]  10.54 68.14 180 top
U1  74HC138N  [DIP-16_L19.2-W6.6-P2.54-LS7.6-BL]  44.43 73.35 270 top
U2  XD74HC245  [DIP-20_L26.8-W6.4-P2.54-LS7.6-BL]  44.58 24.2 270 top
USB1  MicroXNJ  [MICRO-USB-SMD_MICROXNJ]  93.85 58.36 90 top

## Footprints (pads in the part's own frame, mm; a bottom-side part is the same pattern mirrored in y, then rotated)
DIP-16_L19.2-W6.6-P2.54-LS7.6-BL
  oval 1.46x1.825 hole 0.8: 1(-8.89,-3.81) 2(-6.35,-3.81) 3(-3.81,-3.81) 4(-1.27,-3.81) 5(1.27,-3.81) 6(3.81,-3.81) 7(6.35,-3.81) 8(8.89,-3.81) 9(8.89,3.81) 10(6.35,3.81) 11(3.81,3.81) 12(1.27,3.81) 13(-1.27,3.81) 14(-3.81,3.81) 15(-6.35,3.81) 16(-8.89,3.81)
DIP-20_L26.8-W6.4-P2.54-LS7.6-BL
  rect 1.5x2 hole 0.9: 1(-11.43,-3.81)
  oval 1.5x2 hole 0.9: 2(-8.89,-3.81) 3(-6.35,-3.81) 4(-3.81,-3.81) 5(-1.27,-3.81) 6(1.27,-3.81) 7(3.81,-3.81) 8(6.35,-3.81) 9(8.89,-3.81)
  oval 1.524x2 hole 0.9: 10(11.43,-3.81) 11(11.43,3.81) 12(8.89,3.81) 13(6.35,3.81) 14(3.81,3.81) 15(1.27,3.81) 16(-1.27,3.81) 17(-3.81,3.81) 18(-6.35,3.81) 19(-8.89,3.81) 20(-11.43,3.81)
HDR-TH_2P-P2.54-V-M
  rect 2x2 hole 1.2: 1(-1.27,0)
  round 2 hole 1.2: 2(1.27,0)
HDR-TH_3P-P2.54-V-M
  rect 1.7x1.7 hole 1.1: 1(-2.54,0)
  round 1.7 hole 1.1: 2(0,0) 3(2.54,0)
LED-TH_BD3.8-P2.54-RD
  round 1.524 hole 0.9: 1(-1.27,0) 2(1.27,0)
MICRO-USB-SMD_MICROXNJ
  rect 0.4x1.6 smd: 1(-1.3,1.597) 2(-0.65,1.597) 3(0,1.597) 4(0.65,1.597) 5(1.3,1.597)
  round 1.3 hole 0.7: 6(2.425,1.074) 9(-2.425,1.073)
  oval 1.3x1.8 hole 0.7x1.1: 7(3.625,-1.597) 8(-3.625,-1.597)
RES-TH_BD2.3-L3.7-P7.70-D0.9
  round 1.3 hole 0.7: 1(-3.81,0) 2(3.81,0)
RES-TH_BD2.3-L6.5-P10.50-D0.5
  round 1.4 hole 0.7: 1(-5.25,0) 2(5.25,0)
RES-TH_BD2.4-L6.3-P10.30-D0.6
  round 1.524 hole 1: 1(-5.15,0) 2(5.15,0)
SW-TH_6P-L7.0-W7.0-P2.00
  rect 1.6x1.6 hole 1: 1(2.499,2)
  round 1.6 hole 1: 2(2.5,0) 3(2.5,-2) 4(-2.5,2) 5(-2.5,0) 6(-2.5,-2)

## Nets
As in the schematic.

Pads without a net: SW1 1 2 3; SW2 1 2 3; SW3 1 2 3; USB1 2 3 4

## Routing (per net, layer and track width the routed paths; a pad name or vN(x,y) marks a point on that pad's centre or on a via; arc(x,y) is an arc through that point)
VCC: length 293.7
  Top Layer w0.254: 10.67,87.55 10.67,76.89 ; 10.67,87.55 12.98,87.55 SW1.4 ; 10.67,87.55 10.67,93.92 11.56,94.81 H1.1 ; 10.67,76.89 10.67,66.13 ; 10.67,76.89 13.02,76.89 SW2.4 ; USB1.1 89.06,57.06 87,59.12 81.3,59.12 81.28,59.11 ; 10.67,66.13 10.67,61.41 9.53,60.27 6.1,60.27 4.32,58.49 4.32,53.03 5.46,51.88 12.92,51.88 ; 10.67,66.13 10.67,66.14 SW3.4 ; 12.92,51.88 12.92,51.89 12.92,54.91 ; 12.92,51.88 26.87,51.88 ; U2.20 48.39,41.09 50.29,42.99 55.12,42.99 H6.1 59.56,47.44 65.02,47.44 66.17,46.3 66.17,36.18 R20.1 ; 81.28,59.11 R9.2 R8.2 R7.2 R6.2 R5.2 R4.2 81.28,93.16 79.63,94.81 H1.1 ; 81.28,59.11 R10.2 R11.2 ; H4.3 26.86,51.89 26.87,51.88 ; H5.3 40.81,53.32 39.37,51.88 26.87,51.88 ; H1.1 48.26,82.26 U1.16
  Bottom Layer w0.254: H5.3 50.43,45.28 H6.1
$1N957: length 14.6
  Top Layer w0.254: R1.2 31.24,87.89 31.24,87.06 36.07,82.24 U1.1
$1N969: length 14.8
  Top Layer w0.254: R3.2 38.55,77.16 U1.3
$1N1133: length 6.2
  Top Layer w0.254: SW2.5 19.23,78.87
$1N1140: length 6.2
  Top Layer w0.254: SW1.5 19.23,89.6
$1N1148: length 6.2
  Top Layer w0.254: SW3.5 19.23,68.14
$1N1162: length 11.4
  Top Layer w0.254: R2.2 31.69,78.87 32.51,79.7 U1.2
$1N1502: length 40.7
  Top Layer w0.254: U1.4 38.73,74.62 37.59,73.47 37.59,72.58 32.77,67.76 32.77,66.74 30.86,64.84 28.19,64.84 24.89,61.53 14.99,61.53 10.38,56.93 H3.2
$1N1509: length 27
  Top Layer w0.254: U1.5 38.73,72.08 33.78,67.12 33.78,65.22 31.88,63.31 28.45,63.31 24.32,59.19 H4.2
$1N1517: length 19.6
  Top Layer w0.254: H5.2 38.27,58.83 34.92,62.17 34.92,65.98 38.48,69.54 U1.6
$1N1681: length 3.1
  Top Layer w0.254: LED1.2 73.64,89.45 R4.1
$1N1764: length 3.1
  Top Layer w0.254: R5.1 73.64,83.92 LED2.2
$1N2002: length 3.1
  Top Layer w0.254: R6.1 73.64,78.39 LED3.2
$1N2004: length 3.1
  Top Layer w0.254: LED4.2 73.65,72.86 R7.1
$1N2318: length 3.1
  Top Layer w0.254: LED5.2 73.65,67.33 R8.1
$1N2320: length 3.1
  Top Layer w0.254: R9.1 73.65,61.8 LED6.2
$1N2322: length 3
  Top Layer w0.254: R10.1 73.66,56.27 LED7.2
$1N2324: length 3
  Top Layer w0.254: LED8.2 R11.1
$1N2481: length 23.9
  Top Layer w0.254: LED1.1 60.05,89.45 50.29,79.7 U1.15
$1N2515: length 20.2
  Top Layer w0.254: U1.12 51.44,72.08 52.22,72.86 LED4.1
$1N2530: length 20.7
  Top Layer w0.254: LED5.1 53.64,67.33 51.44,69.54 U1.11
$1N2537: length 22
  Top Layer w0.254: U1.10 50.93,67 56.12,61.8 LED6.1
$1N2544: length 23.2
  Top Layer w0.254: U1.9 50.29,64.46 58.48,56.27 LED7.1
$1N2551: length 44.6
  Top Layer w0.254: U1.7 37.47,67 36.2,65.73 36.2,63.06 38.23,61.03 47.88,61.03 58.17,50.74 LED8.1
$1N2573: length 22.6
  Top Layer w0.254: U1.14 50.8,77.16 57.56,83.92 LED2.1
$1N2577: length 21.4
  Top Layer w0.254: LED3.1 55.34,78.39 51.56,74.62 U1.13
$2N664: length 5
  Top Layer w0.254: R12.1 14.6,45.4 LED9.2
$2N666: length 5
  Top Layer w0.254: LED10.2 14.6,39.68 R13.1
$2N668: length 5
  Top Layer w0.254: LED11.2 14.6,33.97 R14.1
$2N670: length 5
  Top Layer w0.254: LED12.2 14.6,28.26 R15.1
$2N672: length 5
  Top Layer w0.254: LED13.2 14.6,22.54 R16.1
$2N674: length 5
  Top Layer w0.254: R17.1 14.6,16.83 LED14.2
$2N676: length 5
  Top Layer w0.254: LED15.2 14.6,11.11
$2N678: length 5
  Top Layer w0.254: LED16.2 R19.1
$2N1075: length 19.7
  Top Layer w0.254: R15.2 25.02,25.47 U2.5
$2N1092: length 18.9
  Top Layer w0.254: R16.2 29.59,22.55 30.23,23.18 40.51,23.18 U2.6
$2N1099: length 21
  Top Layer w0.254: U2.4 28.19,28.01 R14.2
$2N1109: length 22.3
  Top Layer w0.254: R13.2 31.37,30.55 U2.3
$2N1119: length 23.6
  Top Layer w0.254: U2.2 34.54,33.09 R12.2
$2N1129: length 20
  Top Layer w0.254: R17.2 29.34,16.83 32.89,20.39 U2.7
$2N1136: length 21.3
  Top Layer w0.254: U2.8 33.53,17.85 26.8,11.12 R18.2
$2N1143: length 22.6
  Top Layer w0.254: R19.2 24.13,5.4 34.04,15.31 U2.9
$2N1301: length 4.9
  Top Layer w0.254: R20.2 LED17.2
$2N1318: length 76.1
  Top Layer w0.254: LED17.1 83.95,13.66 83.06,12.77 U2.11 U2.12 U2.13 U2.14 U2.15 U2.16 U2.17 U2.18
$2N1542: length 19.7
  Top Layer w0.254: H6.2 59.94,39.95 53.09,33.09 U2.19

## Copper pours and planes (outline as drawn; the poured copper is in the pictures)
GND on Top Layer: -3.05,100.91 102.74,100.91 102.74,-1.84 -3.05,-1.84
GND on Bottom Layer: -11.56,106.49 107.82,106.49 107.82,-6.28 -11.56,-6.28

Small or netless copper shapes (teardrops, artwork), in the pictures only: 140 on Top Layer, 2 on Bottom Layer

## Text on the board
Top Silkscreen Layer: vcc | GND | 138译码电路 | 245信号放大电路
